# Altium schematic sheet 原理图.SCHDOC
size B; ApprovedBy: huangqi; Author: 黄启; Time: 0820
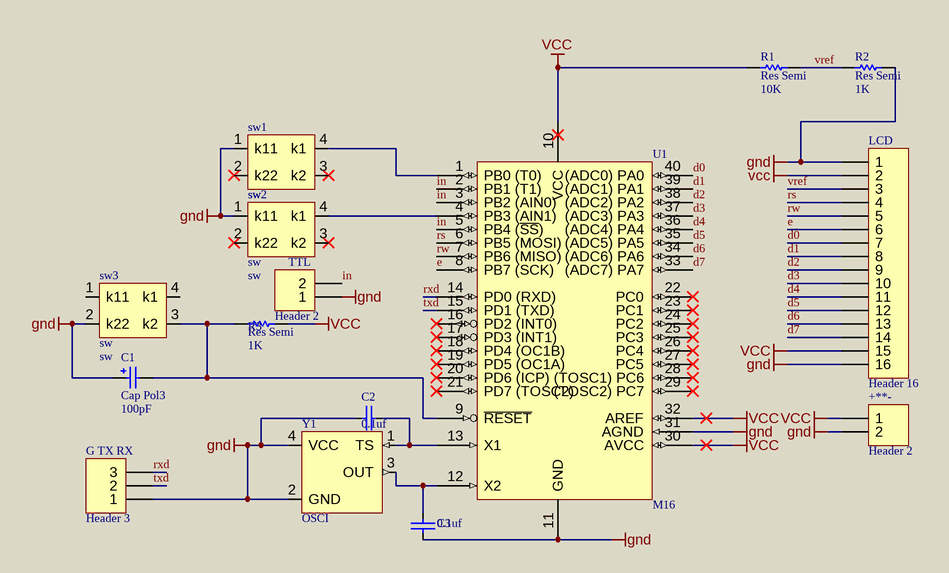
[diagram p0: 原理图.SCHDOC]

## Parts
+**-  Header 2  [HDR1X2]
C1  Cap Pol3  value 100pF  [1206]
C2  vaule: 0.1uf  [0805]
C3  vaule: 0.1uf  [0805]
G_TX_RX  Header 3  [HDR1X3]
LCD  Header 16  [HDR1X16]
R1  Res Semi  value 10K  [0805]
R2  Res Semi  value 1K  [0805]
R3  Res Semi  value 1K  [0805]
sw1  sw  [sw66]
sw2  sw  [sw66]
sw3  sw  [sw66]
TTL  Header 2  [HDR1X2]
U1  M16  [DIP-40]
Y1  OSCI  [RSM200S]

## Nets
gnd: +**-.2 C1.1 C2.1 C3.1 G_TX_RX.1 LCD.1 LCD.16 R2.2 sw1.1(k11) sw2.1(k11) sw3.2(k22) TTL.1 U1.11(GND) U1.31(AGND) Y1.2(GND) Y1.4(VCC)
vcc: +**-.1 LCD.2 LCD.15 R1.1 R3.2 U1.10(VCC) U1.30(AVCC) U1.32(AREF)
d0: LCD.7 U1.40((ADC0)_PA0)
d1: LCD.8 U1.39((ADC1)_PA1)
d2: LCD.9 U1.38((ADC2)_PA2)
d3: LCD.10 U1.37((ADC3)_PA3)
d4: LCD.11 U1.36((ADC4)_PA4)
d5: LCD.12 U1.35((ADC5)_PA5)
d6: LCD.13 U1.34((ADC6)_PA6)
d7: LCD.14 U1.33((ADC7)_PA7)
e: LCD.6 U1.8(PB7_(SCK))
in: TTL.2 U1.2(PB1_(T1)) U1.3(PB2_(AIN0)) U1.5(PB4_(~{SS}))
rs: LCD.4 U1.6(PB5_(MOSI))
rw: LCD.5 U1.7(PB6_(MISO))
rxd: G_TX_RX.3 U1.14(PD0_(RXD))
txd: G_TX_RX.2 U1.15(PD1_(TXD))
vref: LCD.3 R1.2 R2.1
NetC1_2: C1.2 R3.1 sw3.3(k2) U1.9(~{RESET})
NetC2_2: C2.2 U1.13(X1) Y1.1(TS)
NetC3_2: C3.2 U1.12(X2) Y1.3(OUT)
Netsw1_4: sw1.4(k1) U1.1(PB0_(T0))
Netsw2_4: sw2.4(k1) U1.4(PB3_(AIN1))

Not connected (* = marked no-connect by the designer): sw1 2(k22)* 3(k2)*; sw2 2(k22)* 3(k2)*; sw3 1(k11) 4(k1); U1 16(PD2_(INT0))* 17(PD3_(INT1))* 18(PD4_(OC1B))* 19(PD5_(OC1A))* 20(PD6_(ICP))* 21(PD7_(TOSC2))* 22(PC0)* 23(PC1)* 24(PC2)* 25(PC3)* 26(PC4)* 27(PC5)* 28((TOSC1)_PC6)* 29((TOSC2)_PC7)*

## Library data of the parts
+**- TTL = Header 2: Header, 2-Pin; Manufacturer: Generic Components; Class: Connector
C1 = Cap Pol3: Polarized Capacitor (Surface Mount); Manufacturer: Generic Components; Class: Passive; Published: 08/06/2000; Publisher: Altium Hobart Technology Centre; SubClass: Capacitor
C2 C3 = CAP1: uF
G_TX_RX = Header 3: Header, 3-Pin; Manufacturer: Generic Components; Class: Connector
LCD = Header 16: Header, 16-Pin; Manufacturer: Generic Components; Class: Connector
R1-R3 = Res Semi: Semiconductor Resistor; Manufacturer: Generic Components; Class: Passive; Published: 08/06/2000; Publisher: Altium Hobart Technology Centre; SubClass: Resistor
sw1-sw3 = sw: pin to pad: 1>k11 2>k22 3>k1 4>k2; sw: sw
U1 = ATMEGA16_DIP40: Atmel Microcontroller - Library created by carel..  <www.mpfreezone.com>; Part Field 1: *; Part Field 2: *; Part Field 3: *; Part Field 4: *; Part Field 5: *; Part Field 6: *; Part Field 7: *; Part Field 8: *; Part Field 9: *; Part Field 10: *; Part Field 11: *; Part Field 12: *; Part Field 13: *; Part Field 14: *; Part Field 15: *; Part Field 16: *
Y1 = OSCI: OSCILLATOR , SMD 5*7